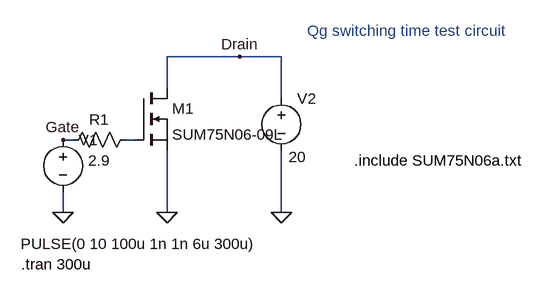
[diagram p0: schematic mosfet_test_circuit_qg.asc]
mosfet_test_circuit_qg.asc, the LTspice schematic file:
Version 4
SHEET 1 880 680
WIRE 320 80 208 80
WIRE 384 80 320 80
WIRE 208 128 208 80
WIRE 384 144 384 80
WIRE 64 208 48 208
WIRE 160 208 144 208
WIRE 48 320 48 288
WIRE 208 320 208 224
WIRE 384 320 384 224
FLAG 48 320 0
FLAG 384 320 0
FLAG 208 320 0
FLAG 48 208 Gate
FLAG 320 80 Drain
SYMBOL nmos 160 128 R0
SYMATTR InstName M1
SYMATTR Value SUM75N06-09L
SYMBOL voltage 48 192 R0
WINDOW 123 0 0 Left 2
WINDOW 39 0 0 Left 2
WINDOW 3 -65 176 Left 2
SYMATTR InstName V1
SYMATTR Value PULSE(0 10 100u 1n 1n 6u 300u)
SYMBOL res 160 192 R90
WINDOW 0 0 56 VBottom 2
WINDOW 3 32 56 VTop 2
SYMATTR InstName R1
SYMATTR Value 2.9
SYMBOL voltage 384 128 R0
WINDOW 123 0 0 Left 2
WINDOW 39 0 0 Left 2
WINDOW 3 11 106 Left 2
SYMATTR InstName V2
SYMATTR Value 20
TEXT -16 400 Left 2 !.tran 300u
TEXT 496 240 Left 2 !.include SUM75N06a.txt
TEXT 424 40 Left 2 ;Qg switching time test circuit

The netlist it stands for:
* mosfet_test_circuit_qg.asc
M1 Drain N001 0 0 SUM75N06-09L
V1 Gate 0 PULSE(0 10 100u 1n 1n 6u 300u)
R1 N001 Gate 2.9
V2 Drain 0 20
.model NMOS NMOS
.model PMOS PMOS
.lib standard.mos
.tran 300u
.include SUM75N06a.txt
* Qg switching time test circuit
.backanno
.end